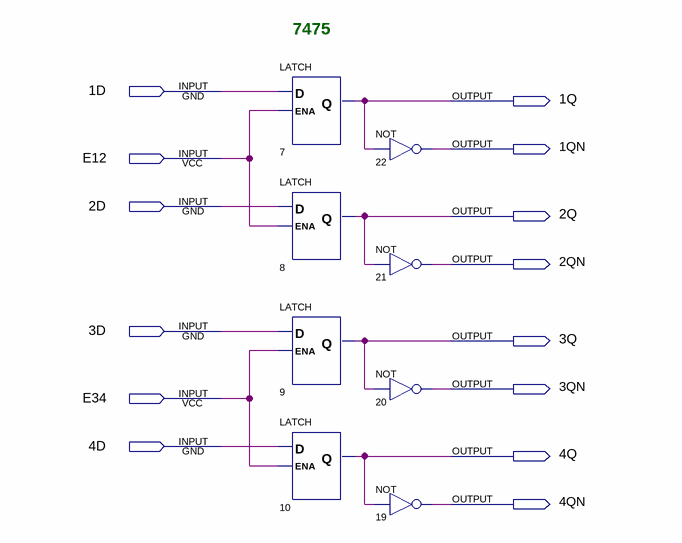
[diagram p0: schematic sheet]
// Quartus schematic 7475.bdf as structural Verilog: 8 symbols, 14 pins
module \7475  (
  input  \1D ,
  input  E12,
  input  \2D ,
  input  \3D ,
  input  E34,
  input  \4D ,
  output \1Q ,
  output \1QN ,
  output \2Q ,
  output \2QN ,
  output \3Q ,
  output \3QN ,
  output \4Q ,
  output \4QN 
);

  LATCH u_7 (.D(\1D ), .ENA(E12), .Q(\1Q ));
  LATCH u_8 (.D(\2D ), .ENA(E12), .Q(\2Q ));
  LATCH u_9 (.D(\3D ), .ENA(E34), .Q(\3Q ));
  LATCH u_10 (.D(\4D ), .ENA(E34), .Q(\4Q ));
  not u_22 (\1QN , \1Q );
  not u_21 (\2QN , \2Q );
  not u_20 (\3QN , \3Q );
  not u_19 (\4QN , \4Q );

  // Notes on the sheet:
  //   7475
endmodule
